# EAGLE design RobotControlBoard (EAGLE 9.6.2)
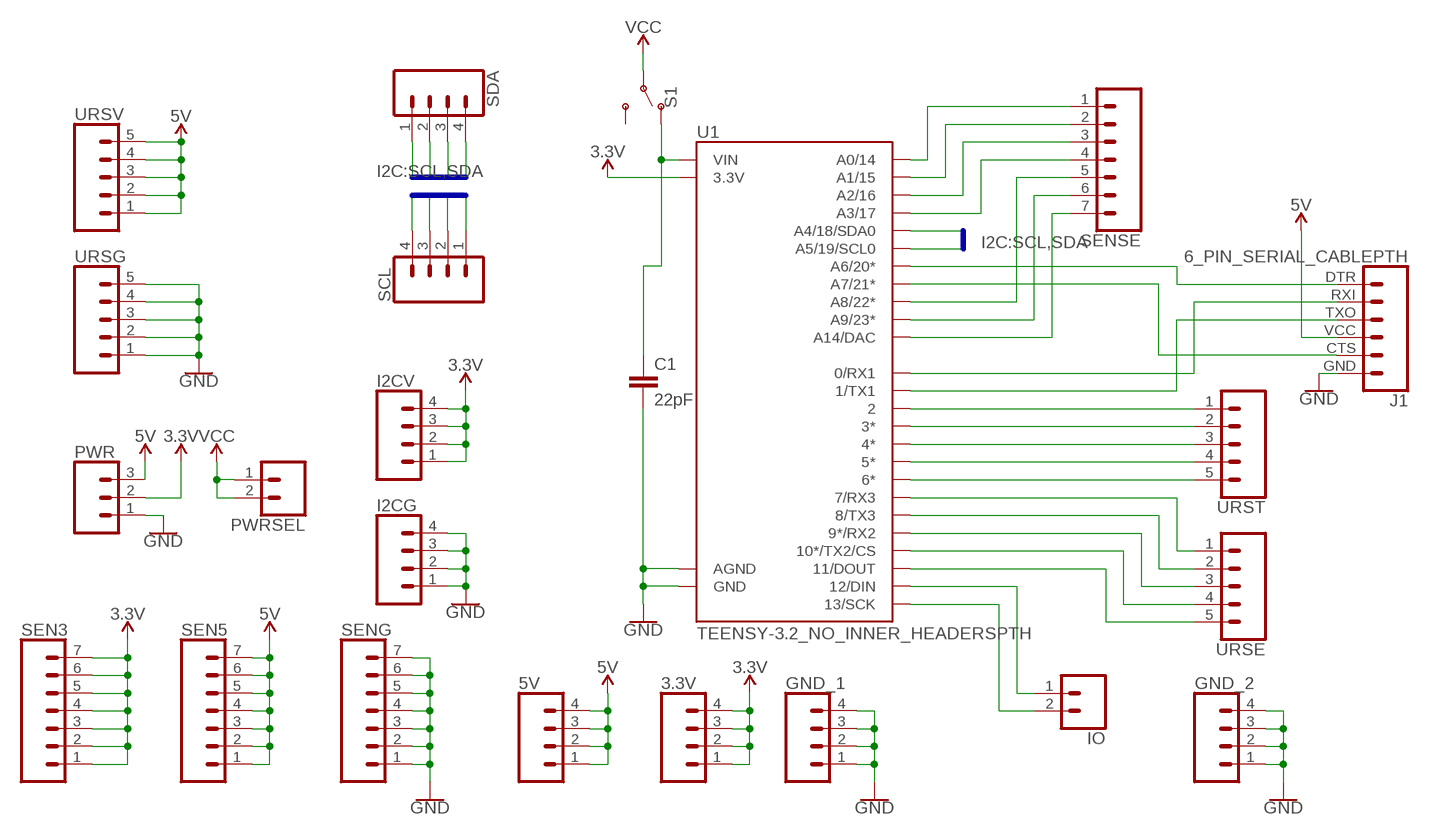
[diagram p0: schematic, sheet 1]

## Parts
3.3V  CONN_04LOCK  [1X04_LOCK]
5V  CONN_04LOCK  [1X04_LOCK]
C1  22pF  22PF-PTH-2.54MM-200V-5%  [CAP-PTH-2.54]
GND_1  CONN_04LOCK  [1X04_LOCK]
GND_2  CONN_04LOCK  [1X04_LOCK]
I2CG  CONN_04LOCK  [1X04_LOCK]
I2CV  CONN_04LOCK  [1X04_LOCK]
IO  CONN_02LOCK  [1X02_LOCK]
J1  6_PIN_SERIAL_CABLEPTH  [FTDI_BASIC]
PWR  CONN_03LOCK  [1X03_LOCK]
PWRSEL  CONN_02LOCK  [1X02_LOCK]
S1  SWITCH-SPDT-PTH-11.6X4.0MM-LOCK  [SWITCH_SPDT_PTH_11.6X4.0MM_LOCK]
SCL  CONN_04LOCK  [1X04_LOCK]
SDA  CONN_04LOCK  [1X04_LOCK]
SEN3  CONN_07LOCK  [1X07_LOCK]
SEN5  CONN_07LOCK  [1X07_LOCK]
SENG  CONN_07LOCK  [1X07_LOCK]
SENSE  CONN_07LOCK  [1X07_LOCK]
U1  TEENSY-3.2_NO_INNER_HEADERSPTH  [TEENSY_TEENSY-3.2-PTH]
URSE  CONN_05LOCK  [1X05_LOCK]
URSG  CONN_05LOCK  [1X05_LOCK]
URST  CONN_05LOCK  [1X05_LOCK]
URSV  CONN_05LOCK  [1X05_LOCK]

## Nets
3.3V: 3.3V.1 3.3V.2 3.3V.3 3.3V.4 I2CV.1 I2CV.2 I2CV.3 I2CV.4 PWR.2 SEN3.1 SEN3.2 SEN3.3 SEN3.4 SEN3.5 SEN3.6 SEN3.7 U1.3.3V U1.3.3V-1(3.3V)
5V: 5V.1 5V.2 5V.3 5V.4 J1.VCC PWR.3 SEN5.1 SEN5.2 SEN5.3 SEN5.4 SEN5.5 SEN5.6 SEN5.7 URSV.1 URSV.2 URSV.3 URSV.4 URSV.5
GND: C1.2 GND_1.1 GND_1.2 GND_1.3 GND_1.4 GND_2.1 GND_2.2 GND_2.3 GND_2.4 I2CG.1 I2CG.2 I2CG.3 I2CG.4 J1.GND PWR.1 SENG.1 SENG.2 SENG.3 SENG.4 SENG.5 SENG.6 SENG.7 U1.AGND U1.GND U1.GND1(GND) URSG.1 URSG.2 URSG.3 URSG.4 URSG.5
N$1: U1.2 URST.1
N$2: U1.3(3*) URST.2
N$3: U1.4(4*) URST.3
N$4: U1.5(5*) URST.4
N$5: U1.6(6*) URST.5
N$6: U1.7(7/RX3) URSE.1
N$7: U1.8(8/TX3) URSE.2
N$8: U1.9(9*/RX2) URSE.3
N$9: U1.10(10*/TX2/CS) URSE.4
N$10: U1.11(11/DOUT) URSE.5
N$11: J1.RXI U1.0(0/RX1)
N$12: J1.TXO U1.1(1/TX1)
N$13: SENSE.1 U1.14(A0/14)
N$14: SENSE.2 U1.15(A1/15)
N$15: SENSE.3 U1.16(A2/16)
N$16: SENSE.4 U1.17(A3/17)
N$17: J1.DTR U1.20(A6/20*)
N$18: J1.CTS U1.21(A7/21*)
N$19: SENSE.5 U1.22(A8/22*)
N$20: SENSE.6 U1.23(A9/23*)
N$21: SENSE.7 U1.A14/DAC
N$22: C1.1 S1.1(O) U1.VIN
N$23: IO.1 U1.12(12/DIN)
N$24: IO.2 U1.13(13/SCK)
SCL: SCL.1 SCL.2 SCL.3 SCL.4 U1.19(A5/19/SCL0)
SDA: SDA.1 SDA.2 SDA.3 SDA.4 U1.18(A4/18/SDA0)
VCC: PWRSEL.1 PWRSEL.2 S1.2(P)
Unconnected: S1.3(S)

## Buses
I2C:SCL,SDA

## Library data of the parts
3.3V 5V GND_1 GND_2 I2CG I2CV SCL SDA = SparkFun-Connectors:CONN_04: Multi connection point. Often used as Generic Header-pin footprint for 0.1 inch spaced/style header connections On any of the 0.1 inch spaced packages, you can populate with these: Break Away Headers - Straight <https://www.sparkfun.com/products/116> (PRT-00116) Break Away Male Headers - Right Angle <https://www.sparkfun.com/products/553> (PRT-00553) Female Headers <https://www.sparkfun.com/products/115> (PRT-00115) Break Away Headers - Machine Pin <https://www.sparkfun.com/products/117> (PRT-00117) Break Away Female Headers - Swiss Machine Pin <https://www.sparkfun.com/products/743> (PRT-00743) For SCREWTERMINALS and SPRING TERMINALS visit here: Screw Terimnals on SparkFun.com <https://www.sparkfun.com/search/results?term=Screw+Terminals> (5mm/3.5mm/2.54mm spacing) This device is also useful as a general connection point to wire up your design to another part of your project. Our various solder wires solder well into these plated through hole pads. Hook-Up Wire - Assortment (Stranded, 22 AWG) <https://www.sparkfun.com/products/11375> (PRT-11375) Hook-Up Wire - Assortment (Solid Core, 22 AWG) <https://www.sparkfun.com/products/11367> (PRT-11367) View the entire wire category on our website here <https://www.sparkfun.com/categories/141> Special notes: Molex polarized connector foot print use with SKU : PRT-08231 with associated crimp pins and housings. 1MM SMD Version SKU: PRT-10208; PROD_ID: CONN-09696
C1 = SparkFun-Capacitors:22PF: 22pF ceramic capacitors A capacitor is a passive two-terminal electrical component used to store electrical energy temporarily in an electric field.; PROD_ID: CAP-09128
IO PWRSEL = SparkFun-Connectors:CONN_02: Multi connection point. Often used as Generic Header-pin footprint for 0.1 inch spaced/style header connections On any of the 0.1 inch spaced packages, you can populate with these: Break Away Headers - Straight <https://www.sparkfun.com/products/116> (PRT-00116) Break Away Male Headers - Right Angle <https://www.sparkfun.com/products/553> (PRT-00553) Female Headers <https://www.sparkfun.com/products/115> (PRT-00115) Break Away Headers - Machine Pin <https://www.sparkfun.com/products/117> (PRT-00117) Break Away Female Headers - Swiss Machine Pin <https://www.sparkfun.com/products/743> (PRT-00743) For SCREWTERMINALS and SPRING TERMINALS visit here: Screw Terimnals on SparkFun.com <https://www.sparkfun.com/search/results?term=Screw+Terminals> (5mm/3.5mm/2.54mm spacing) This device is also useful as a general connection point to wire up your design to another part of your project. Our various solder wires solder well into these plated through hole pads. Hook-Up Wire - Assortment (Stranded, 22 AWG) <https://www.sparkfun.com/products/11375> (PRT-11375) Hook-Up Wire - Assortment (Solid Core, 22 AWG) <https://www.sparkfun.com/products/11367> (PRT-11367) View the entire wire category on our website here <https://www.sparkfun.com/categories/141> Special notes: Molex polarized connector foot print use with: PRT-08233 with associated crimp pins and housings. 2.54_SCREWTERM for use with PRT-10571. 3.5mm Screw Terminal footprints for PRT-08084 5mm Screw Terminal footprints for use with PRT-08432
J1 = SparkFun-Connectors:6_PIN_SERIAL_CABLE: 6-pin header connection for use with the "FTDI BASIC" pinout - CABLE SIDE. Also known as "Arduino Serial Program Header". This is used on a design to provide a 6-pin connection point for serial communication usually from a USB cable (D+/D-) to these headers (RX/TX). It also has the remaining pins necessary for programming in the Arduino evironment (DTR, GND, and sometimes VCC). Note, this device has "CABLE" in the name. It is intended to be used on a design that usually lives on the end of your USB cable and prvides the converter chip (FTDI232 or FTDI231x) to commnicate serial RX/TX. The "sister" device, named "TARGET" is inteneded to be used on a design that contains a target micro-controller that you wish to program. You can populate with some of these: Female Headers <https://www.sparkfun.com/products/115> (PRT-00115) For reference (or to suit your programming needs) check out these designs: SparkFun FTDI Basic Breakout - 5V <https://www.sparkfun.com/products/9716> (DEV-09716) SparkFun FTDI Basic Breakout - 3.3V <https://www.sparkfun.com/products/9873> (DEV-09873) SparkFun FTDI SmartBasic <https://www.sparkfun.com/products/12935> (DEV-12935) SparkFun Beefy 3 - FTDI Basic Breakout <https://www.sparkfun.com/products/13746> (DEV-13746)
PWR = SparkFun-Connectors:CONN_03: Multi connection point. Often used as Generic Header-pin footprint for 0.1 inch spaced/style header connections On any of the 0.1 inch spaced packages, you can populate with these: Break Away Headers - Straight <https://www.sparkfun.com/products/116> (PRT-00116) Break Away Male Headers - Right Angle <https://www.sparkfun.com/products/553> (PRT-00553) Female Headers <https://www.sparkfun.com/products/115> (PRT-00115) Break Away Headers - Machine Pin <https://www.sparkfun.com/products/117> (PRT-00117) Break Away Female Headers - Swiss Machine Pin <https://www.sparkfun.com/products/743> (PRT-00743) Stackable Header - 3 Pin (Female, 0.1") <https://www.sparkfun.com/products/13875> (PRT-13875) For SCREWTERMINALS and SPRING TERMINALS visit here: Screw Terimnals on SparkFun.com <https://www.sparkfun.com/search/results?term=Screw+Terminals> (5mm/3.5mm/2.54mm spacing) This device is also useful as a general connection point to wire up your design to another part of your project. Our various solder wires solder well into these plated through hole pads. Hook-Up Wire - Assortment (Stranded, 22 AWG) <https://www.sparkfun.com/products/11375> (PRT-11375) Hook-Up Wire - Assortment (Solid Core, 22 AWG) <https://www.sparkfun.com/products/11367> (PRT-11367) View the entire wire category on our website here <https://www.sparkfun.com/categories/141> Special notes: Molex polarized connector foot print use with SKU : PRT-08232 with associated crimp pins and housings.
S1 = SparkFun-Switches:SWITCH-SPDT: Single Pole, Double Throw (SPDT) Switch Single-pole, double-throw (SPDT) switch. Variant Overview SMD-AYZ0202 Surface Mount DPDT Switch <https://www.sparkfun.com/products/597> (COM-00597) Used on e.g. LilyPad Arduino USB - ATmega32U4 Board <https://www.sparkfun.com/products/12049> PTH-11.6X4.0MM SPDT Mini Power Switch <https://www.sparkfun.com/products/102> (COM-00102) Used on e.g. SparkFun Simon Says - Through-Hole Soldering Kit <https://www.sparkfun.com/products/10547> (KIT-10547) PTH-11.6X4.0MM-KIT KIT version of SPDT Mini Power Switch - Simplifies soldering by removing tStop of switch pins - only one side can be soldered. PTH-11.6X4.0MM-LOCK LOCK version of SPDT Mini Power Switch - Offset pins hold switch in place for easier soldering. SMD-RIGHT-ANGLE Surface Mount Right Angle Switch <https://www.sparkfun.com/products/10860> (COM-10860) Used on e.g. SparkFun ESP8266 Thing <https://www.sparkfun.com/products/13231>; PROD_ID: SWCH-08261; SF_SKU: COM-00102
SEN3 SEN5 SENG SENSE = SparkFun-Connectors:CONN_07: Multi connection point. Often used as Generic Header-pin footprint for 0.1 inch spaced/style header connections On any of the 0.1 inch spaced packages, you can populate with these: Break Away Headers - Straight <https://www.sparkfun.com/products/116> (PRT-00116) Break Away Male Headers - Right Angle <https://www.sparkfun.com/products/553> (PRT-00553) Female Headers <https://www.sparkfun.com/products/115> (PRT-00115) Break Away Headers - Machine Pin <https://www.sparkfun.com/products/117> (PRT-00117) Break Away Female Headers - Swiss Machine Pin <https://www.sparkfun.com/products/743> (PRT-00743) For SCREWTERMINALS and SPRING TERMINALS visit here: Screw Terimnals on SparkFun.com <https://www.sparkfun.com/search/results?term=Screw+Terminals> (5mm/3.5mm/2.54mm spacing) This device is also useful as a general connection point to wire up your design to another part of your project. Our various solder wires solder well into these plated through hole pads. Hook-Up Wire - Assortment (Stranded, 22 AWG) <https://www.sparkfun.com/products/11375> (PRT-11375) Hook-Up Wire - Assortment (Solid Core, 22 AWG) <https://www.sparkfun.com/products/11367> (PRT-11367) View the entire wire category on our website here <https://www.sparkfun.com/categories/141> Special notes: Molex polarized connector foot print use with SKU : PRT-08231 with associated crimp pins and housings. 1MM SMD Version SKU: PRT-10208 NOTES ON THE VARIANTS LOCK and LOCK_LONGPADS... This footprint was designed to help hold the alignment of a through-hole component (i.e. 6-pin header) while soldering it into place. You may notice that each hole has been shifted either up or down by 0.005 of an inch from it's more standard position (which is a perfectly straight line). This slight alteration caused the pins (the squares in the middle) to touch the edges of the holes. Because they are alternating, it causes a "brace" to hold the component in place. 0.005 has proven to be the perfect amount of "off-center" position when using our standard breakaway headers. Although looks a little odd when you look at the bare footprint, once you have a header in there, the alteration is very hard to notice. Also,if you push a header all the way into place, it is covered up entirely on the bottom side.
U1 = SparkFun-Boards:TEENSY-3.2_NO_INNER_HEADERS
URSE URSG URST URSV = SparkFun-Connectors:CONN_05: Multi connection point. Often used as Generic Header-pin footprint for 0.1 inch spaced/style header connections On any of the 0.1 inch spaced packages, you can populate with these: Break Away Headers - Straight <https://www.sparkfun.com/products/116> (PRT-00116) Break Away Male Headers - Right Angle <https://www.sparkfun.com/products/553> (PRT-00553) Female Headers <https://www.sparkfun.com/products/115> (PRT-00115) Break Away Headers - Machine Pin <https://www.sparkfun.com/products/117> (PRT-00117) Break Away Female Headers - Swiss Machine Pin <https://www.sparkfun.com/products/743> (PRT-00743) For SCREWTERMINALS and SPRING TERMINALS visit here: Screw Terimnals on SparkFun.com <https://www.sparkfun.com/search/results?term=Screw+Terminals> (5mm/3.5mm/2.54mm spacing) This device is also useful as a general connection point to wire up your design to another part of your project. Our various solder wires solder well into these plated through hole pads. Hook-Up Wire - Assortment (Stranded, 22 AWG) <https://www.sparkfun.com/products/11375> (PRT-11375) Hook-Up Wire - Assortment (Solid Core, 22 AWG) <https://www.sparkfun.com/products/11367> (PRT-11367) View the entire wire category on our website here <https://www.sparkfun.com/categories/141> Special notes: Molex polarized connector foot print use with SKU : PRT-08231 with associated crimp pins and housings. 1MM SMD Version SKU: PRT-10208

## Board
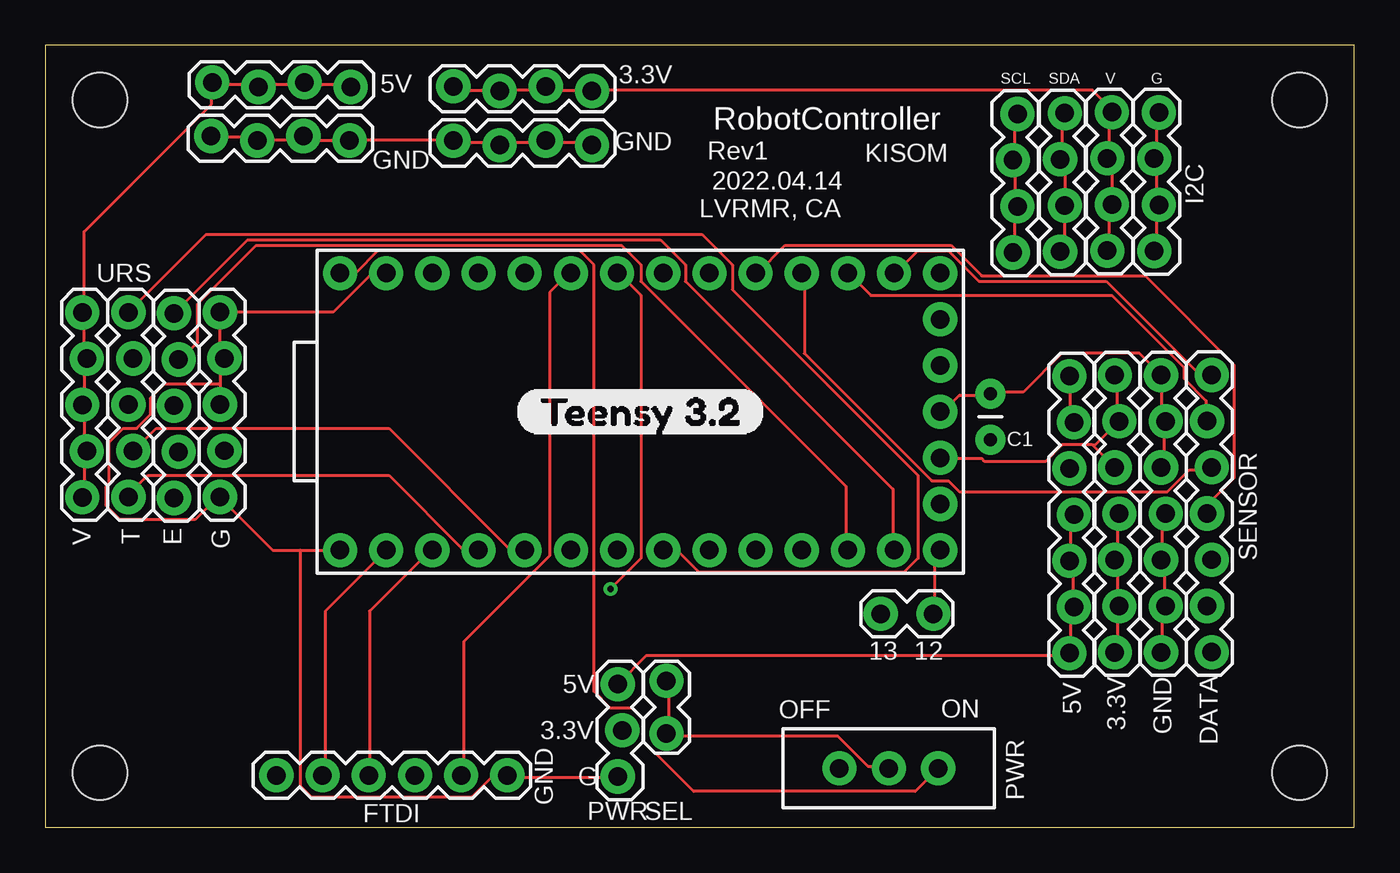
[diagram p1: board, top side]
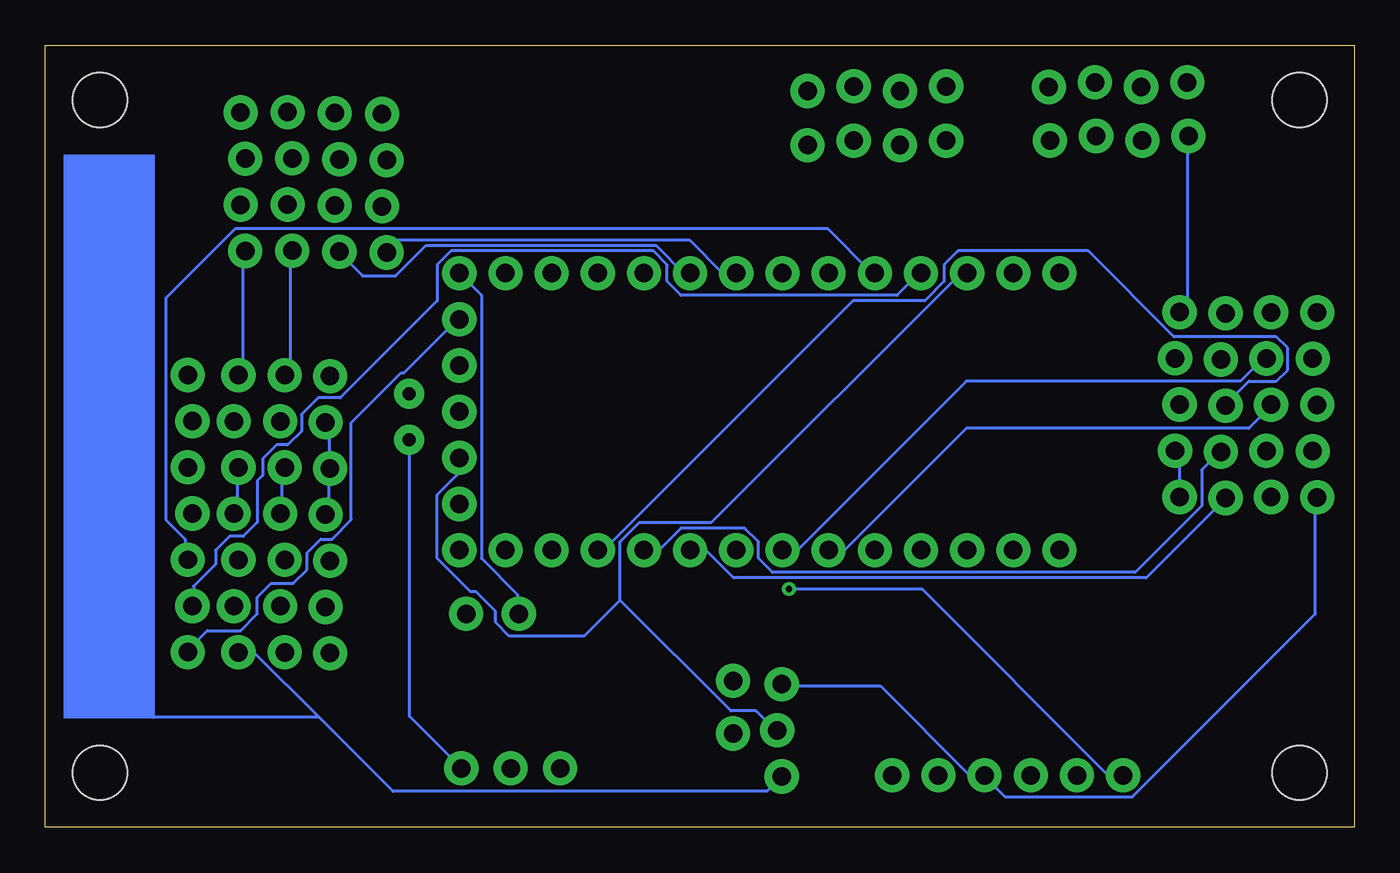
[diagram p2: board, bottom side, seen from below]

Size 72 x 43 mm. Coordinates in mm from the lower left corner, seen from the top.
Outline: 0,0 72,0 72,43 0,43 0,0
Copper layers (1*16): Top 0.035mm / dielectric 1.5mm / Bottom 0.035mm
Design rules "default": minimum track width 6mil, minimum drill 0.35mm, track to track 6mil, track to pad 6mil, pad to pad 6mil, via to via 6mil, smd to smd 6mil, copper to edge 40mil, drill to drill 6mil, minimum pad ring 10mil, minimum via ring 8mil, stop-mask expansion 4mil, vias tented up to drill 0mil, thermal gap 10mil
Holes 3 mm at 3,3 3,40 69,40 69,3

### Footprints (pad centres in the part's own frame; a part is rotated, then mirrored left to right if it is on the bottom)
1X04_LOCK = drill 1.016 pad 1.88: 1 0,0.127; 2 2.54,-0.127; 3 5.08,0.127; 4 7.62,-0.127
CAP-PTH-2.54 = drill 0.7 pad 1.651: 1 -1.27,0; 2 1.27,0
1X02_LOCK = drill 1.016 pad 1.88: 1 -0.178,0; 2 2.718,0
FTDI_BASIC = drill 1.016 pad 1.88: CTS 10.16,0; DTR 0,0; GND 12.7,0; RXI 2.54,0; TXO 5.08,0; VCC 7.62,0
1X03_LOCK = drill 1.016 pad 1.88: 1 0,0.127; 2 2.54,-0.127; 3 5.08,0.127
SWITCH_SPDT_PTH_11.6X4.0MM_LOCK = drill 1.016 pad 1.88: 1 0,2.718; 2 0,0; 3 0,-2.718
1X07_LOCK = drill 1.016 pad 1.88: 1 0,0.127; 2 2.54,-0.127; 3 5.08,0.127; 4 7.62,-0.127; 5 10.16,0.127; 6 12.7,-0.127; 7 15.24,0.127
TEENSY_TEENSY-3.2-PTH = drill 1.016 pad 1.88: 0 -13.97,-7.62; 1 -11.43,-7.62; 2 -8.89,-7.62; 3 -6.35,-7.62; 3.3V 16.51,-2.54; 3.3V-1 -11.43,7.62; 4 -3.81,-7.62; 5 -1.27,-7.62; 6 1.27,-7.62; 7 3.81,-7.62; 8 6.35,-7.62; 9 8.89,-7.62; 10 11.43,-7.62; 11 13.97,-7.62; 12 16.51,-7.62; 13 16.51,7.62; 14 13.97,7.62; 15 11.43,7.62; 16 8.89,7.62; 17 6.35,7.62; 18 3.81,7.62; 19 1.27,7.62; 20 -1.27,7.62; 21 -3.81,7.62; 22 -6.35,7.62; 23 -8.89,7.62; A14/DAC 16.51,5.08; AGND -13.97,7.62; GND 16.51,0; GND1 -16.51,-7.62; PROG 16.51,2.54; VBAT 16.51,-5.08; VIN -16.51,7.62
1X05_LOCK = drill 1.016 pad 1.88: 1 0,0.127; 2 2.54,-0.127; 3 5.08,0.127; 4 7.62,-0.127; 5 10.16,0.127

### Placement (x,y rotation side)
3.3V  22.45,40.62 0 top
5V  16.8,40.85 180 top
C1  51.99,22.58 90 top
GND_1  9.11,37.9 0 top
GND_2  22.45,37.64 0 top
I2CG  61.13,39.31 270 top
I2CV  58.55,31.71 90 top
IO  48.67,11.74 180 top
J1  12.71,2.86 0 top
PWR  31.61,2.79 90 top
PWRSEL  34.16,5.33 90 top
S1  46.4,3.24 270 top
SCL  53.35,39.23 270 top
SDA  55.96,39.28 270 top
SEN3  58.96,9.62 90 top
SEN5  56.47,9.57 90 top
SENG  61.51,9.62 90 top
SENSE  64.04,24.87 270 top
U1  32.72,22.86 0 top
URSE  7.2,18.11 90 top
URSG  9.72,18.17 90 top
URST  4.7,18.16 90 top
URSV  2.15,18.15 90 top

### Tracks (layer width: path | path; a pad name or v marks a point on that pad's centre or on a via)
3.3V
  Top 0.152: I2CV.1 58.52,31.85 58.52,33.98 58.67,34.14 I2CV.2 58.67,34.29 58.67,36.58 58.52,36.73 I2CV.3 58.52,36.88 58.52,39.17 I2CV.4 58.67,39.47 57.61,40.54 30.18,40.54 3.3V.4 30.02,40.54 27.74,40.54 27.58,40.69 3.3V.3 27.43,40.69 27.28,40.54 24.99,40.54 3.3V.2 24.84,40.54 22.71,40.54 22.55,40.69 3.3V.1 | SEN3.1 58.98,9.75 58.98,12.04 SEN3.2 58.98,12.19 58.98,14.63 SEN3.3 58.98,14.78 58.98,17.22 SEN3.4 | 57.61,21.03 55.93,21.03 55.02,20.12 51.66,20.12 51.51,20.27 49.38,20.27 U1.3.3V | 57.61,21.03 58.83,19.81 SEN3.5 | 57.61,21.03 57.76,21.03 58.98,22.25 SEN3.6 58.98,22.4 58.98,24.84 SEN3.7
  Bottom 0.152: SEN3.5 58.98,19.66 58.98,17.37 SEN3.4 | I2CV.1 58.52,31.7 58.52,25.3 58.83,24.99 SEN3.7 | U1.3.3V-1 21.64,30.48 35.36,16.76 39.32,16.76 40.39,15.7 40.39,12.5 | 40.39,12.5 34.29,6.4 32.92,6.4 31.85,5.33 PWR.2 | 40.39,12.5 42.37,10.52 46.48,10.52 47.24,11.28 47.24,11.89 48.31,12.95 48.62,12.95 50.44,14.78 50.44,18.29 49.38,19.36 49.38,20.27 U1.3.3V
5V
  Top 0.152: SEN5.7 56.39,24.69 56.39,22.55 56.54,22.4 SEN5.6 | SEN5.4 56.54,17.07 56.39,16.92 56.39,14.78 SEN5.3 56.39,14.63 56.54,14.48 56.54,12.19 SEN5.2 56.54,12.04 56.39,11.89 56.39,9.6 SEN5.1 56.24,9.45 33.07,9.45 31.55,7.92 PWR.3 | URSV.1 2.13,18.29 2.13,20.57 URSV.2 2.13,20.73 2.13,23.16 URSV.3 2.13,23.32 2.13,25.76 URSV.4 2.13,25.91 2.13,28.19 URSV.5 2.13,28.35 2.13,32.77 9.14,39.78 9.14,40.84 5V.4 9.3,40.84 11.58,40.84 5V.3 11.73,40.84 14.17,40.84 5V.2 14.33,40.84 16.76,40.84 5V.1
  Bottom 0.152: SEN5.6 56.54,22.25 56.39,22.1 56.39,19.81 SEN5.5 56.39,19.66 56.39,17.37 56.54,17.22 SEN5.4 | PWR.3 31.39,7.77 26.06,7.77 21.18,2.9 20.42,2.9 J1.VCC 20.27,2.74 19.2,1.68 12.19,1.68 2.13,11.73 2.13,18.14 URSV.1
GND
  Top 0.152: I2CG.4 61.11,31.7 61.11,34.14 I2CG.3 61.11,34.29 61.11,36.73 I2CG.2 61.11,36.88 61.11,39.17 I2CG.1 | U1.GND 49.38,22.86 50.29,23.77 51.97,23.77 C1.2 52.12,23.93 53.8,23.93 55.93,26.06 60.2,26.06 61.27,24.99 SENG.7 61.42,24.84 61.42,22.55 61.57,22.4 SENG.6 61.57,22.25 61.57,19.96 61.42,19.81 SENG.5 | SENG.1 61.42,9.75 61.42,11.89 61.57,12.04 SENG.2 61.57,12.19 61.57,14.48 61.42,14.63 SENG.3 61.42,14.78 61.42,17.07 61.57,17.22 SENG.4 | 9.6,24.38 9.6,25.6 9.75,25.76 URSG.4 9.75,25.91 9.6,26.06 9.6,28.19 URSG.5 9.6,28.35 15.85,28.35 17.98,30.48 U1.AGND | 9.6,24.38 9.6,23.32 URSG.3 | PWR.1 31.39,2.74 25.45,2.74 J1.GND 25.3,2.74 24.54,2.74 23.47,1.68 14.63,1.68 14.02,2.29 14.02,15.24 | 14.02,15.24 12.5,15.24 9.6,18.14 URSG.1 9.45,18.14 8.23,16.92 4.12,16.92 3.35,17.68 3.35,18.75 3.5,18.9 3.5,21.18 4.27,21.95 5.03,21.95 5.79,22.71 5.79,23.62 6.55,24.38 9.6,24.38 | 14.02,15.24 U1.GND1 | GND_1.1 9.14,37.95 11.43,37.95 11.58,37.8 GND_1.2 11.73,37.8 14.02,37.8 14.17,37.95 GND_1.3 14.33,37.95 14.48,37.8 16.61,37.8 GND_1.4 16.76,37.8 22.4,37.8 GND_2.1 22.55,37.64 24.84,37.64 GND_2.2 24.99,37.64 27.43,37.64 GND_2.3 27.58,37.64 30.02,37.64 GND_2.4
  Bottom 0.152: SENG.5 61.42,19.66 61.42,17.53 61.57,17.37 SENG.4 | I2CG.4 61.11,31.55 61.11,25.15 61.27,24.99 SENG.7 | URSG.1 9.6,18.29 9.6,20.42 9.75,20.57 URSG.2 | 56.95,6.05 52.88,1.98 32.31,1.98 31.55,2.74 PWR.1 | 56.95,6.05 60.5,9.6 61.27,9.6 SENG.1 | GND_1.1 9.14,37.95 9.14,28.65 9.45,28.35 URSG.5 | 56.95,6.05 | 56.95,6.05 66.05,6.05 69,9
  pour Bottom: 66,37 71,37 71,6 67,6 66,6
N$1
  Top 0.152: U1.2 23.01,15.24 18.9,19.36 5.64,19.36 4.57,18.29 URST.1
N$2
  Top 0.152: U1.3 25.6,15.24 18.9,21.95 6.1,21.95 4.88,20.73 URST.2
N$3
  Bottom 0.152: U1.4 28.04,15.24 21.34,21.95 5.79,21.95 4.57,23.16 URST.3
N$4
  Bottom 0.152: U1.5 30.63,15.24 21.34,24.54 6.25,24.54 4.88,25.91 URST.4
N$5
  Top 0.152: U1.6 34.75,15.24 35.97,14.02 47.24,14.02 48.01,14.78 48.01,19.36 37.8,29.57 37.8,30.94 36.12,32.61 8.84,32.61 4.57,28.35 URST.5
N$6
  Bottom 0.152: U1.7 35.66,15.24 34.14,13.72 11.43,13.72 7.16,17.98 URSE.1
N$7
  Bottom 0.152: U1.8 38.25,15.24 37.03,16.46 33.53,16.46 32.77,15.7 32.77,14.78 32,14.02 12.04,14.02 8.38,17.68 8.38,19.66 7.47,20.57 URSE.2
N$8
  Bottom 0.152: U1.9 41.3,15.24 27.58,28.96 23.62,28.96 22.55,30.02 22.55,30.94 21.79,31.7 14.63,31.7 9.91,26.98 4.27,26.98 3.66,26.36 3.66,25.15 4.27,24.54 5.79,24.54 7.01,23.32 URSE.3
N$9
  Top 0.152: U1.10 44.04,15.24 44.04,18.75 32.77,30.02 32.77,30.94 31.7,32 11.58,32 8.38,28.8 8.38,26.67 7.47,25.76 URSE.4
N$10
  Top 0.152: U1.11 46.63,15.24 46.63,18.59 35.2,30.02 35.2,30.94 33.83,32.31 11.12,32.31 7.16,28.35 URSE.5
N$11
  Top 0.152: J1.RXI 15.39,2.9 15.39,11.89 U1.0
N$12
  Top 0.152: J1.TXO 17.83,2.9 17.83,11.89 21.18,15.24 U1.1
N$13
  Top 0.152: SENSE.1 64.16,24.99 63.4,24.99 58.37,30.02 51.36,30.02 49.68,31.7 48.01,31.7 46.79,30.48 U1.14
N$14
  Top 0.152: SENSE.2 63.86,22.4 63.86,23.47 62.64,24.69 62.64,25.3 58.67,29.26 45.41,29.26 44.2,30.48 U1.15
N$15
  Top 0.152: SENSE.3 64.16,19.66 62.94,19.66 61.72,18.44 50.29,18.44 49.68,19.05 48.77,19.05 41.76,26.06 41.76,30.48 U1.16
N$16
  Top 0.152: SENSE.4 64.01,17.37 64.01,17.83 65.38,19.2 65.38,25.45 60.5,30.33 51.51,30.33 49.84,32 40.69,32 39.17,30.48 U1.17
N$17  (via drill 0.35)
  Top 0.152: v31.09,13.11 32.77,14.78 32.77,29.26 31.55,30.48 U1.20
  Bottom 0.152: v31.09,13.11 23.77,13.11 13.56,2.9 12.8,2.9 J1.DTR
N$18
  Top 0.152: J1.CTS 23.01,2.9 23.01,10.21 27.74,14.94 27.74,29.41 28.8,30.48 U1.21
N$19
  Bottom 0.152: SENSE.5 64.31,14.78 64.31,15.85 65.38,16.92 65.38,29.11 61.57,32.92 28.96,32.92 26.52,30.48 U1.22
N$20
  Bottom 0.152: SENSE.6 63.86,12.19 63.86,13.26 62.64,14.48 62.64,15.24 61.87,16 61.11,16 60.35,16.76 60.35,19.05 60.05,19.36 60.05,20.27 59.28,21.03 58.67,21.03 57.91,21.79 57.91,22.71 57,23.62 55.78,23.62 50.44,28.96 50.44,30.94 49.68,31.7 38.56,31.7 37.8,30.94 37.8,30.02 37.03,29.26 25.15,29.26 23.93,30.48 U1.23
N$21
  Bottom 0.152: U1.A14/DAC 49.38,27.89 52.27,24.99 52.43,24.99 55.17,22.25 55.17,16.92 56.24,15.85 56.84,15.85 57.61,15.09 57.61,14.17 58.37,13.41 59.59,13.41 60.35,12.65 60.35,11.73 61.27,10.82 63.09,10.82 64.16,9.75 SENSE.7
N$22
  Top 0.152: U1.VIN 17.07,30.48 18.29,31.7 29.41,31.7 30.18,30.94 30.18,7.47 31.09,6.55 32.31,6.55 32.92,5.94 32.92,4.72 35.66,1.98 47.85,1.98 49.07,3.2 S1.1
  Bottom 0.152: C1.1 51.97,21.18 51.97,6.1 49.23,3.35 S1.1
N$23
  Top 0.152: IO.1 48.92,11.89 48.92,14.94 U1.12
N$24
  Bottom 0.152: IO.2 46.02,11.89 46.02,12.8 48.01,14.78 48.01,29.26 U1.13
SCL
  Top 0.152: SCL.1 53.34,39.17 53.34,36.73 SCL.2 53.34,36.58 53.34,34.29 SCL.3 53.34,34.14 53.34,31.7 SCL.4
  Bottom 0.152: U1.19 34.75,30.48 36.58,32.31 52.58,32.31 53.19,31.7 SCL.4
SDA
  Top 0.152: SDA.1 56.08,39.17 55.93,39.01 55.93,36.88 SDA.2 55.93,36.73 56.08,36.58 56.08,34.29 SDA.3 56.08,34.14 56.08,31.85 55.93,31.7 SDA.4
  Bottom 0.152: U1.18 36.88,30.48 38.41,32 51.05,32 52.73,30.33 54.56,30.33 55.78,31.55 SDA.4
VCC
  Top 0.152: PWRSEL.2 34.29,7.92 34.29,5.18 PWRSEL.1 34.29,5.03 43.59,5.03 45.26,3.35 46.33,3.35 S1.2
(copper drawn outside any net)
  shapes: Bottom area x1

### Text on the board
tPlace: 5V | 3.3V | SCL | SDA | V | G | RobotController | GND | GND | Rev1 | KISOM | 2022.04.14 | I2C | LVRMR, CA | URS | SENSOR | V | T | E | G | 13 | 12 | 5V | ON | 5V | 3.3V | GND | OFF | DATA | 3.3V | GND | G | PWR | FTDI | PWR | SEL